# EAGLE design HDMI Test Board (EAGLE 6.2)
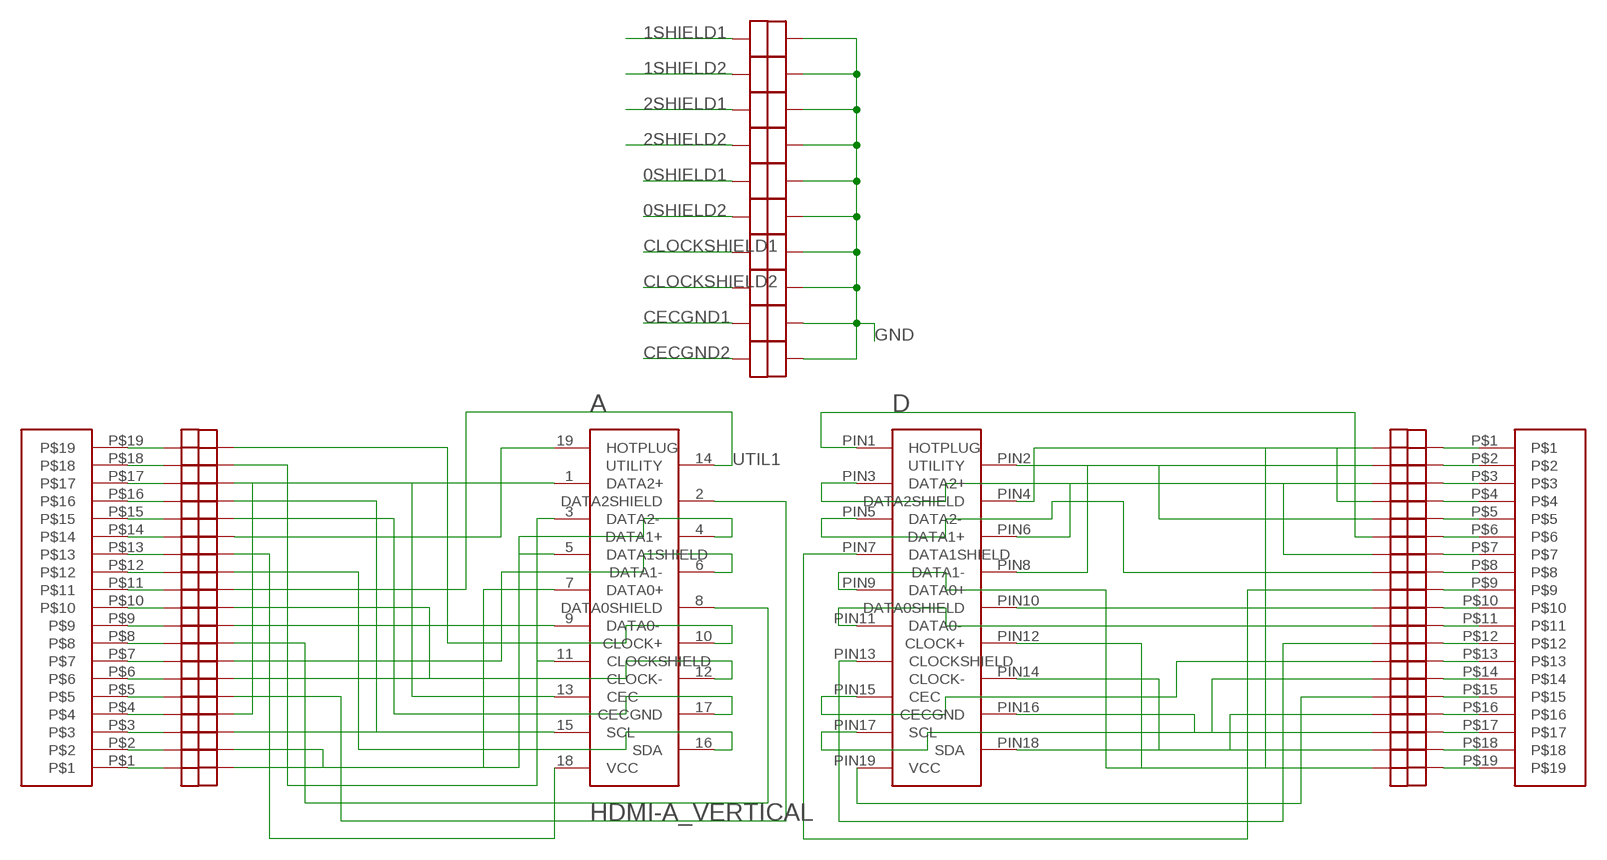
[diagram p0: schematic, sheet 1]

## Parts
A  HDMI-A_VERTICAL  [KDMIX-SL]
D  HDMI-D  [MICRO_HDMI]
U$2  1X2-HEADER  [1X2-HEADER]
U$3  1X19-HEADER  [1X19-HEADER]
U$4  1X19-HEADER  [1X19-HEADER]
U$5  1X2-HEADER  [1X2-HEADER]
U$6  1X2-HEADER  [1X2-HEADER]
U$7  1X2-HEADER  [1X2-HEADER]
U$8  1X2-HEADER  [1X2-HEADER]
U$9  1X2-HEADER  [1X2-HEADER]
U$10  1X2-HEADER  [1X2-HEADER]
U$11  1X2-HEADER  [1X2-HEADER]
U$12  1X2-HEADER  [1X2-HEADER]
U$13  1X2-HEADER  [1X2-HEADER]
U$14  1X2-HEADER  [1X2-HEADER]
U$15  1X2-HEADER  [1X2-HEADER]
U$16  1X2-HEADER  [1X2-HEADER]
U$17  1X2-HEADER  [1X2-HEADER]
U$18  1X2-HEADER  [1X2-HEADER]
U$19  1X2-HEADER  [1X2-HEADER]
U$20  1X2-HEADER  [1X2-HEADER]
U$21  1X2-HEADER  [1X2-HEADER]
U$22  1X2-HEADER  [1X2-HEADER]
U$23  1X2-HEADER  [1X2-HEADER]
U$24  1X2-HEADER  [1X2-HEADER]
U$25  1X2-HEADER  [1X2-HEADER]
U$26  1X2-HEADER  [1X2-HEADER]
U$27  1X2-HEADER  [1X2-HEADER]
U$28  1X2-HEADER  [1X2-HEADER]
U$29  1X2-HEADER  [1X2-HEADER]
U$30  1X2-HEADER  [1X2-HEADER]
U$31  1X2-HEADER  [1X2-HEADER]
U$32  1X2-HEADER  [1X2-HEADER]
U$33  1X2-HEADER  [1X2-HEADER]
U$34  1X2-HEADER  [1X2-HEADER]
U$35  1X2-HEADER  [1X2-HEADER]
U$36  1X2-HEADER  [1X2-HEADER]
U$37  1X2-HEADER  [1X2-HEADER]
U$38  1X2-HEADER  [1X2-HEADER]
U$39  1X2-HEADER  [1X2-HEADER]
U$40  1X2-HEADER  [1X2-HEADER]
U$41  1X2-HEADER  [1X2-HEADER]
U$42  1X2-HEADER  [1X2-HEADER]
U$43  1X2-HEADER  [1X2-HEADER]
U$44  1X2-HEADER  [1X2-HEADER]
U$45  1X2-HEADER  [1X2-HEADER]
U$46  1X2-HEADER  [1X2-HEADER]
U$47  1X2-HEADER  [1X2-HEADER]
U$48  1X2-HEADER  [1X2-HEADER]
U$49  1X2-HEADER  [1X2-HEADER]
U$50  1X2-HEADER  [1X2-HEADER]
U$51  1X2-HEADER  [1X2-HEADER]

## Nets
0+1: A.7(DATA0+) U$11.P$2
0+2: D.PIN9(DATA0+) U$30.P$1
0-1: A.9(DATA0-) U$12.P$2
0-2: D.PIN11(DATA0-) U$31.P$1
0SHIELD1: A.8(DATA0SHIELD) U$21.P$2 U$47.P$1
0SHIELD2: D.PIN10(DATA0SHIELD) U$40.P$1 U$46.P$1
1+1: A.4(DATA1+) U$9.P$2
1+2: D.PIN6(DATA1+) U$28.P$1
1-1: A.6(DATA1-) U$10.P$2
1-2: D.PIN8(DATA1-) U$29.P$1
1SHIELD1: A.5(DATA1SHIELD) U$20.P$2 U$51.P$1
1SHIELD2: D.PIN7(DATA1SHIELD) U$39.P$1 U$50.P$1
2+1: A.1(DATA2+) U$7.P$2
2+2: D.PIN3(DATA2+) U$26.P$1
2-1: A.3(DATA2-) U$8.P$2
2-2: D.PIN5(DATA2-) U$27.P$1
2SHIELD1: A.2(DATA2SHIELD) U$19.P$2 U$49.P$1
2SHIELD2: D.PIN4(DATA2SHIELD) U$38.P$1 U$48.P$1
CEC1: A.13(CEC) U$15.P$2
CEC2: D.PIN15(CEC) U$34.P$1
CECGND1: A.17(CECGND) U$2.P$1 U$16.P$2
CECGND2: D.PIN16(CECGND) U$35.P$1 U$43.P$1
CLOCK+1: A.10(CLOCK+) U$13.P$2
CLOCK+2: D.PIN12(CLOCK+) U$32.P$1
CLOCK-1: A.12(CLOCK-) U$14.P$2
CLOCK-2: D.PIN14(CLOCK-) U$33.P$1
CLOCKSHIELD1: A.11(CLOCKSHIELD) U$22.P$2 U$45.P$1
CLOCKSHIELD2: D.PIN13(CLOCKSHIELD) U$41.P$1 U$44.P$1
GND: U$2.P$2 U$43.P$2 U$44.P$2 U$45.P$2 U$46.P$2 U$47.P$2 U$48.P$2 U$49.P$2 U$50.P$2 U$51.P$2
HOTPLUG1: A.19(HOTPLUG) U$5.P$2
HOTPLUG2: D.PIN1(HOTPLUG) U$24.P$1
N$1: U$4.P$14 U$5.P$1
N$2: U$4.P$11 U$6.P$1
N$3: U$4.P$4 U$7.P$1
N$4: U$4.P$3 U$8.P$1
N$5: U$4.P$6 U$9.P$1
N$6: U$4.P$7 U$10.P$1
N$7: U$4.P$1 U$11.P$1
N$8: U$4.P$19 U$12.P$1
N$9: U$4.P$9 U$13.P$1
N$10: U$4.P$10 U$14.P$1
N$11: U$4.P$17 U$15.P$1
N$12: U$4.P$15 U$16.P$1
N$13: U$4.P$16 U$17.P$1
N$14: U$4.P$12 U$18.P$1
N$15: U$4.P$5 U$19.P$1
N$16: U$4.P$2 U$20.P$1
N$17: U$4.P$8 U$21.P$1
N$18: U$4.P$18 U$22.P$1
N$19: U$4.P$13 U$23.P$1
N$20: U$3.P$6 U$24.P$2
N$21: U$3.P$5 U$25.P$2
N$22: U$3.P$7 U$26.P$2
N$23: U$3.P$8 U$27.P$2
N$24: U$3.P$3 U$28.P$2
N$25: U$3.P$2 U$29.P$2
N$26: U$3.P$10 U$30.P$2
N$27: U$3.P$11 U$31.P$2
N$28: U$3.P$19 U$32.P$2
N$29: U$3.P$18 U$33.P$2
N$30: U$3.P$13 U$34.P$2
N$31: U$3.P$17 U$35.P$2
N$32: U$3.P$14 U$36.P$2
N$33: U$3.P$16 U$37.P$2
N$34: U$3.P$4 U$38.P$2
N$35: U$3.P$9 U$39.P$2
N$36: U$3.P$1 U$40.P$2
N$37: U$3.P$12 U$41.P$2
N$38: U$3.P$15 U$42.P$2
SCL1: A.15(SCL) U$17.P$2
SCL2: D.PIN17(SCL) U$36.P$1
SDA1: A.16(SDA) U$18.P$2
SDA2: D.PIN18(SDA) U$37.P$1
UTIL1: A.14(UTILITY) U$6.P$2
UTILITY2: D.PIN2(UTILITY) U$25.P$1
VCC1: A.18(VCC) U$23.P$2
VCC2: D.PIN19(VCC) U$42.P$1

## Library data of the parts
A = voigts:HDMI-A_VERTICAL
D = voigts:HDMI-D
U$2 U$5-U$51 = josh:1X2-HEADER
U$3 U$4 = josh:1X19-HEADER

## Board
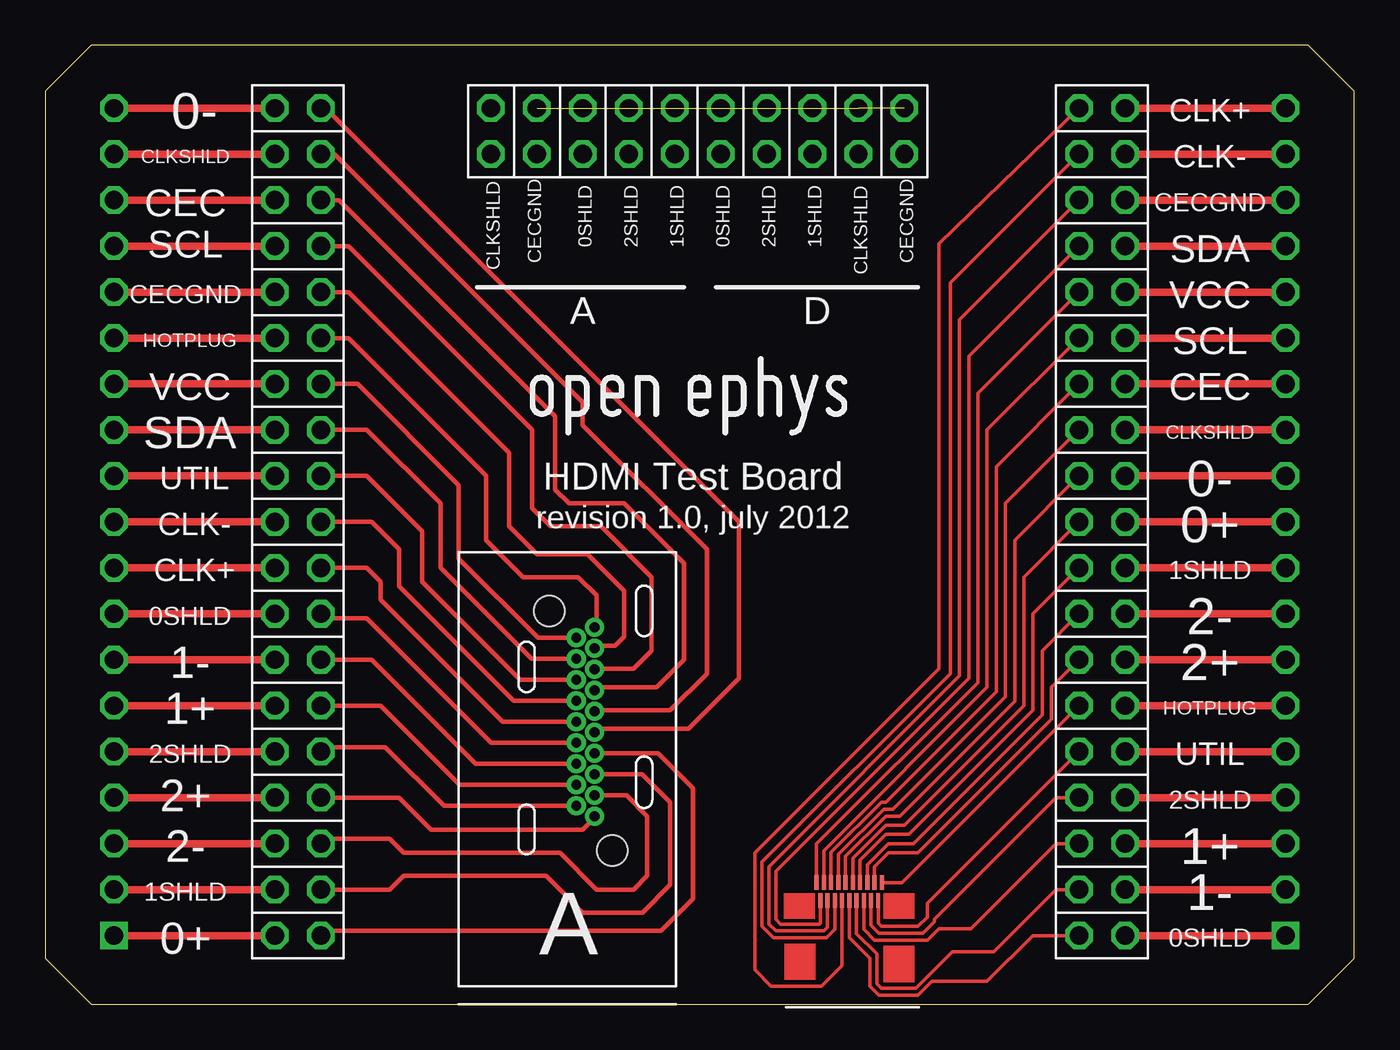
[diagram p1: board, top side]
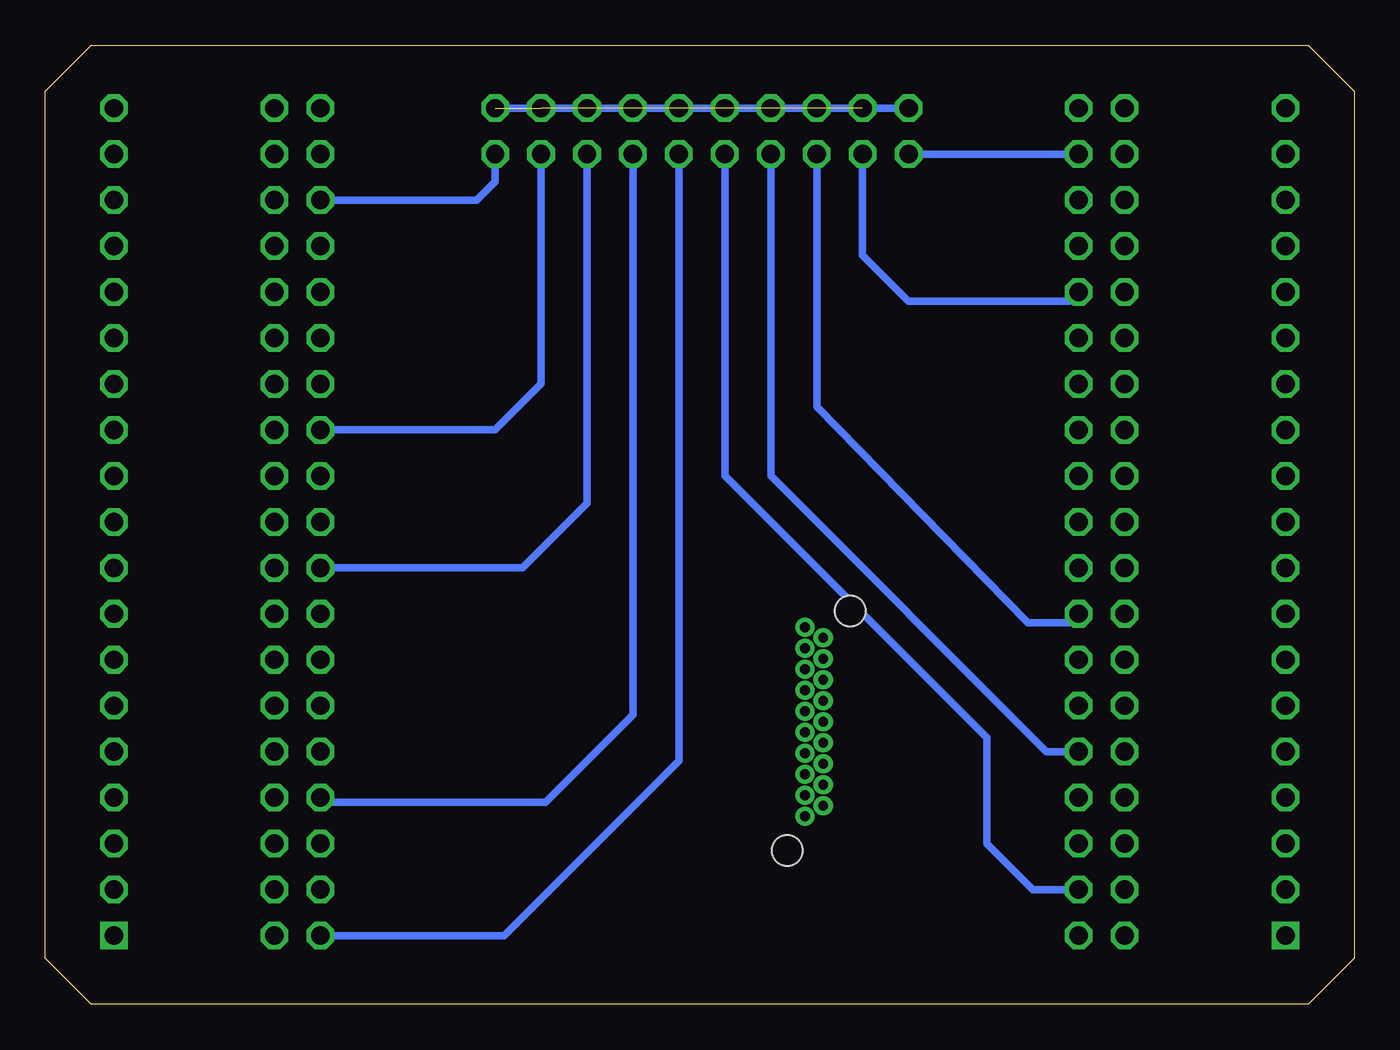
[diagram p2: board, bottom side, seen from below]

Size 72.37 x 53.01 mm. Coordinates in mm from the lower left corner, seen from the top.
Outline: 0,50.47 0,2.54 2.54,0 69.83,0 72.37,2.54 72.37,50.47 69.83,53.01 2.54,53.01 0,50.47
Copper layers (1*16): Top 0.035mm / dielectric 1.5mm / Bottom 0.035mm
Design rules: minimum track width 10mil, minimum drill 24mil, track to track 8mil, track to pad 8mil, pad to pad 8mil, via to via 8mil, smd to smd 8mil, copper to edge 40mil, drill to drill 8mil, minimum pad ring 10mil, minimum via ring 8mil, stop-mask expansion 4mil, vias tented up to drill 0mil, thermal gap 10mil

### Footprints (pad centres in the part's own frame; a part is rotated, then mirrored left to right if it is on the bottom)
KDMIX-SL = drill 0.55 pad 0.72: 1 7.5,10.4; 2 6.5,10.98; 3 7.5,11.56; 4 6.5,12.14; 5 7.5,12.72; 6 6.5,13.3; 7 7.5,13.88; 8 6.5,14.46; 9 7.5,15.04; 10 6.5,15.62; 11 7.5,16.2; 12 6.5,16.78; 13 7.5,17.36; 14 6.5,17.94; 15 7.5,18.52; 16 6.5,19.1; 17 7.5,19.68; 18 6.5,20.26; 19 7.5,20.84 | hole 1.7: 8.5,8.5; 5,21.75
MICRO_HDMI = smd 0.22 x 0.8: PIN1 1.8,1.4; PIN2 1.6,0.4; PIN3 1.4,1.4; PIN4 1.2,0.4; PIN5 1,1.4; PIN6 0.8,0.4; PIN7 0.6,1.4; PIN8 0.4,0.4; PIN9 0.2,1.4; PIN10 0,0.4; PIN11 -0.2,1.4; PIN12 -0.4,0.4; PIN13 -0.6,1.4; PIN14 -0.8,0.4; PIN15 -1,1.4; PIN16 -1.2,0.4; PIN17 -1.4,1.4; PIN18 -1.6,0.4; PIN19 -1.8,1.4
1X2-HEADER = drill 1.016 octagon: P$1 0,0; P$2 2.54,0
1X19-HEADER = drill 1.016 square: P$1 0,0 | drill 1.016 octagon: P$2 2.54,0; P$3 5.08,0; P$4 7.62,0; P$5 10.16,0; P$6 12.7,0; P$7 15.24,0; P$8 17.78,0; P$9 20.32,0; P$10 22.86,0; P$11 25.4,0; P$12 27.94,0; P$13 30.48,0; P$14 33.02,0; P$15 35.56,0; P$16 38.1,0; P$17 40.64,0; P$18 43.18,0; P$19 45.72,0

### Placement (x,y rotation side)
A  22.86,0 0 top
D  44.45,5.33 0 top
U$1  [OPEN_EPHYS_LOGO]  26.16,30.99 0 top
U$2  27.18,46.99 90 top
U$3  68.58,3.81 90 top
U$4  3.81,3.81 90 top
U$5  12.7,36.83 0 top
U$6  12.7,29.21 0 top
U$7  12.7,11.43 0 top
U$8  12.7,8.89 0 top
U$9  12.7,16.51 0 top
U$10  12.7,19.05 0 top
U$11  12.7,3.81 0 top
U$12  12.7,49.53 0 top
U$13  12.7,24.13 0 top
U$14  12.7,26.67 0 top
U$15  12.7,44.45 0 top
U$16  12.7,39.37 0 top
U$17  12.7,41.91 0 top
U$18  12.7,31.75 0 top
U$19  12.7,13.97 0 top
U$20  12.7,6.35 0 top
U$21  12.7,21.59 0 top
U$22  12.7,46.99 0 top
U$23  12.7,34.29 0 top
U$24  57.15,16.51 0 top
U$25  57.15,13.97 0 top
U$26  57.15,19.05 0 top
U$27  57.15,21.59 0 top
U$28  57.15,8.89 0 top
U$29  57.15,6.35 0 top
U$30  57.15,26.67 0 top
U$31  57.15,29.21 0 top
U$32  57.15,49.53 0 top
U$33  57.15,46.99 0 top
U$34  57.15,34.29 0 top
U$35  57.15,44.45 0 top
U$36  57.15,36.83 0 top
U$37  57.15,41.91 0 top
U$38  57.15,11.43 0 top
U$39  57.15,24.13 0 top
U$40  57.15,3.81 0 top
U$41  57.15,31.75 0 top
U$42  57.15,39.37 0 top
U$43  47.5,46.99 90 top
U$44  44.96,46.99 90 top
U$45  24.64,46.99 90 top
U$46  37.34,46.99 90 top
U$47  29.72,46.99 90 top
U$48  39.88,46.99 90 top
U$49  32.26,46.99 90 top
U$50  42.42,46.99 90 top
U$51  34.8,46.99 90 top

### Tracks (layer width: path | path; a pad name or v marks a point on that pad's centre or on a via)
0+1
  Top 0.254: A.7 33.87,13.88 35.81,11.94 35.81,5.84 34.04,4.06 15.49,4.06 U$11.P$2
0+2
  Top 0.203: D.PIN9 44.65,8.07 46.48,9.91 47.5,9.91 54.1,16.51 54.1,23.62 U$30.P$1
0-1
  Top 0.254: U$12.P$2 15.49,49.53 38.35,26.67 38.35,18.03 35.56,15.24 30.56,15.24 A.9
0-2
  Top 0.203: D.PIN11 44.25,8.18 46.48,10.41 47.24,10.41 53.59,16.76 53.59,25.65 U$31.P$1
0SHIELD1
  Top 0.254: A.8 24.66,14.46 17.78,21.34 15.49,21.34 U$21.P$2
  Bottom 0.406: U$47.P$1 29.72,33.02 18.03,21.08 15.75,21.08 U$21.P$2
0SHIELD2
  Top 0.203: D.PIN10 44.45,3.68 45.59,2.54 45.59,1.02 46.1,0.51 48.26,0.51 49.02,1.27 52.07,1.27 54.61,3.81 U$40.P$1
  Bottom 0.406: U$46.P$1 37.34,13.46 46.99,3.81 U$40.P$1
1+1
  Top 0.254: A.4 22.91,12.14 18.54,16.51 U$9.P$2
1+2
  Top 0.203: D.PIN6 45.25,4.15 45.85,3.56 48.77,3.56 49.4,4.19 51.18,4.19 55.88,8.89 U$28.P$1
1-1
  Top 0.254: A.6 23.78,13.3 18.03,19.05 U$10.P$2
1-2
  Top 0.203: D.PIN8 44.85,3.92 45.97,2.79 45.97,1.14 46.23,0.89 48.13,0.89 50.16,2.92 52.45,2.92 55.88,6.35 U$29.P$1
1SHIELD1
  Top 0.254: A.5 33,12.72 34.54,11.18 34.54,6.6 33.02,5.08 29.72,5.08 27.69,7.11 19.81,7.11 19.05,6.35 U$20.P$2
  Bottom 0.406: U$51.P$1 34.8,29.21 20.32,14.73 20.32,8.89 17.78,6.35 U$20.P$2
1SHIELD2
  Top 0.203: D.PIN7 45.05,7.97 46.48,9.4 47.75,9.4 54.61,16.26 54.61,21.59 U$39.P$1
  Bottom 0.406: U$50.P$1 42.42,27.69 45.97,24.13 U$39.P$1
2+1
  Top 0.254: A.1 30.36,10.29 29.72,9.65 21.34,9.65 19.56,11.43 U$7.P$2
2+2
  Top 0.203: D.PIN3 45.85,7.62 46.61,8.38 48.26,8.38 55.63,15.75 55.63,17.53 U$26.P$1
2-1
  Top 0.254: A.3 32.13,11.56 33.27,10.41 33.27,7.11 32.51,6.35 30.48,6.35 28.45,8.38 19.81,8.38 19.05,9.14 15.49,9.14 U$8.P$2
2-2
  Top 0.203: D.PIN5 45.45,7.73 46.61,8.89 48.01,8.89 55.12,16 55.12,19.56 U$27.P$1
2SHIELD1
  Top 0.254: A.2 22.04,10.98 18.8,14.22 15.49,14.22 U$19.P$2
  Bottom 0.406: U$49.P$1 32.26,29.21 17.02,13.97 U$19.P$2
2SHIELD2
  Top 0.203: D.PIN4 45.65,4.39 46.1,3.94 48.51,3.94 49.15,4.57 49.15,4.7 55.88,11.43 U$38.P$1
  Bottom 0.406: U$48.P$1 39.88,16 44.7,11.18 56.9,11.18 U$38.P$1
CEC1
  Top 0.254: U$15.P$2 16.26,44.45 28.19,32.51 28.19,28.45 28.96,27.69 32,27.69 35.31,24.38 35.31,19.05 33.78,17.53 30.53,17.53 A.13
CEC2
  Top 0.203: D.PIN15 43.45,8.4 46.23,11.18 46.48,11.18 52.58,17.27 52.58,29.72 U$34.P$1
CECGND1
  Top 0.254: U$16.P$2 16.76,39.37 25.65,30.48 25.65,26.42 27.18,24.89 29.97,24.89 32,22.86 32,20.32 31.5,19.81 30.49,19.81 A.17
  Bottom 0.406: U$2.P$1 27.18,41.4 24.64,38.86 15.75,38.86 U$16.P$2
CECGND2
  Top 0.203: D.PIN16 43.25,4.26 43.05,4.06 40.39,4.06 40.01,4.45 40.01,7.62 50.55,18.16 50.55,37.85 U$35.P$1
  Bottom 0.406: U$43.P$1 47.5,45.47 48.51,44.45 U$35.P$1
CLOCK+1
  Top 0.254: A.10 25.27,15.62 18.54,22.35 18.54,23.37 17.78,24.13 U$13.P$2
CLOCK+2
  Top 0.203: D.PIN12 44.05,2.14 42.93,1.02 40.13,1.02 39.24,1.91 39.24,8.38 49.4,18.54 49.4,42.04 U$32.P$1
CLOCK-1
  Top 0.254: A.12 25.89,16.78 19.56,23.11 19.56,25.15 18.03,26.67 U$14.P$2
CLOCK-2
  Top 0.203: D.PIN14 43.65,4.15 43.18,3.68 40.26,3.68 39.62,4.32 39.62,7.87 50.04,18.29 50.04,39.88 U$33.P$1
CLOCKSHIELD1
  Top 0.254: U$22.P$2 16,46.99 29.72,33.27 29.72,32 36.58,25.15 36.58,18.29 34.54,16.26 30.42,16.26 A.11
  Bottom 0.406: U$45.P$1 U$22.P$2
CLOCKSHIELD2
  Top 0.203: D.PIN13 43.85,8.29 46.35,10.79 46.86,10.79 53.09,17.02 53.09,27.69 U$41.P$1
  Bottom 0.406: U$44.P$1 44.96,34.29 47.5,31.75 U$41.P$1
GND  (8 unrouted)
  Bottom 0.406: U$45.P$2 U$43.P$2
HOTPLUG1
  Top 0.254: U$5.P$2 16.76,36.83 24.38,29.21 24.38,25.65 26.42,23.62 29.46,23.62 30.48,22.61 30.48,20.96 A.19
HOTPLUG2
  Top 0.203: D.PIN1 47.37,6.73 U$24.P$1
N$1
  Top 0.406: U$4.P$14 U$5.P$1
N$2
  Top 0.406: U$4.P$11 U$6.P$1
N$3
  Top 0.406: U$4.P$4 U$7.P$1
N$4
  Top 0.406: U$4.P$3 U$8.P$1
N$5
  Top 0.406: U$4.P$6 U$9.P$1
N$6
  Top 0.406: U$4.P$7 U$10.P$1
N$7
  Top 0.406: U$4.P$1 U$11.P$1
N$8
  Top 0.406: U$4.P$19 U$12.P$1
N$9
  Top 0.406: U$4.P$9 U$13.P$1
N$10
  Top 0.406: U$4.P$10 U$14.P$1
N$11
  Top 0.406: U$4.P$17 U$15.P$1
N$12
  Top 0.406: U$4.P$15 U$16.P$1
N$13
  Top 0.406: U$4.P$16 U$17.P$1
N$14
  Top 0.406: U$4.P$12 U$18.P$1
N$15
  Top 0.406: U$4.P$5 U$19.P$1
N$16
  Top 0.406: U$4.P$2 U$20.P$1
N$17
  Top 0.406: U$4.P$8 U$21.P$1
N$18
  Top 0.406: U$4.P$18 U$22.P$1
N$19
  Top 0.406: U$4.P$13 U$23.P$1
N$20
  Top 0.406: U$24.P$2 U$3.P$6
N$21
  Top 0.406: U$25.P$2 U$3.P$5
N$22
  Top 0.406: U$26.P$2 U$3.P$7
N$23
  Top 0.406: U$27.P$2 U$3.P$8
N$24
  Top 0.406: U$28.P$2 U$3.P$3
N$25
  Top 0.406: U$29.P$2 U$3.P$2
N$26
  Top 0.406: U$30.P$2 U$3.P$10
N$27
  Top 0.406: U$31.P$2 U$3.P$11
N$28
  Top 0.406: U$32.P$2 U$3.P$19
N$29
  Top 0.406: U$33.P$2 U$3.P$18
N$30
  Top 0.406: U$34.P$2 U$3.P$13
N$31
  Top 0.406: U$35.P$2 U$3.P$17
N$32
  Top 0.406: U$36.P$2 U$3.P$14
N$33
  Top 0.406: U$37.P$2 U$3.P$16
N$34
  Top 0.406: U$38.P$2 U$3.P$4
N$35
  Top 0.406: U$39.P$2 U$3.P$9
N$36
  Top 0.406: U$40.P$2 U$3.P$1
N$37
  Top 0.406: U$41.P$2 U$3.P$12
N$38
  Top 0.406: U$42.P$2 U$3.P$15
SCL1
  Top 0.254: U$17.P$2 16.76,41.91 26.92,31.75 26.92,27.43 27.94,26.42 30.73,26.42 33.53,23.62 33.53,19.56 32.51,18.54 30.38,18.54 A.15
SCL2
  Top 0.203: D.PIN17 43.05,8.51 52.07,17.53 52.07,31.75 U$36.P$1
SDA1
  Top 0.254: A.16 26.87,19.1 21.84,24.13 21.84,27.69 17.78,31.75 U$18.P$2
SDA2
  Top 0.203: D.PIN18 42.85,4.5 42.8,4.45 40.64,4.45 40.39,4.7 40.39,7.37 51.05,18.03 51.05,35.81 U$37.P$1
UTIL1
  Top 0.254: A.14 26.26,17.94 20.83,23.37 20.83,26.16 17.78,29.21 U$6.P$2
UTILITY2
  Top 0.203: D.PIN2 46.05,4.5 46.23,4.32 48.26,4.32 48.77,4.83 48.77,5.59 U$25.P$1
VCC1
  Top 0.254: A.18 27.24,20.26 22.86,24.64 22.86,28.7 17.27,34.29 U$23.P$2
VCC2
  Top 0.203: D.PIN19 42.65,8.87 51.56,17.78 51.56,33.78 U$42.P$1

### Text on the board
tPlace: 0- | CLK+ | CLKSHLD | CLK- | CEC | 0SHLD | 2SHLD | 1SHLD | 0SHLD | 2SHLD | 1SHLD | CECGND | CLKSHLD | CECGND | CLKSHLD | CECGND | SCL | SDA | CECGND | VCC | A | D | HOTPLUG | SCL | VCC | CEC | SDA | CLKSHLD | UTIL | HDMI Test Board | 0- | CLK- | revision 1.0, july 2012 | 0+ | CLK+ | 1SHLD | 0SHLD | 2- | 1- | 2+ | 1+ | HOTPLUG | 2SHLD | UTIL | 2+ | 2SHLD | 2- | 1+ | 1SHLD | 1- | 0+ | 0SHLD